# EAGLE schematic lighting (EAGLE 9.7.0)
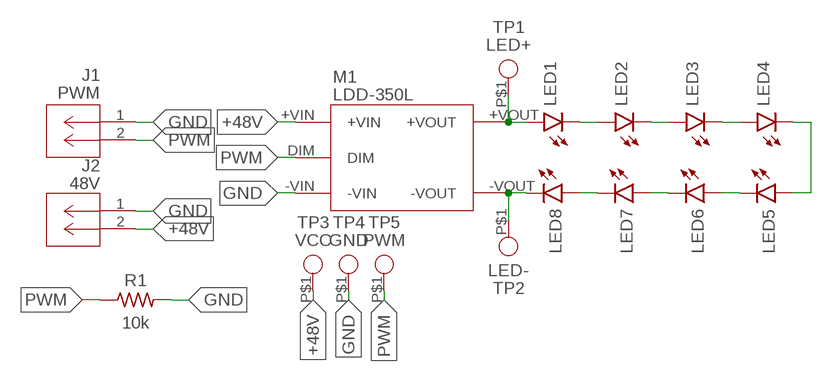
[diagram p0: schematic, sheet 1]

## Parts
J1  PWM  MICROLOCK-2PIN  [2PIN]
J2  48V  2PINCON_436500201_MOL  [2PIN]
LED1  XLAMP_XP-G3_ROYAL  [XLAMP_XP-G3]
LED2  XLAMP_XP-G3_ROYAL  [XLAMP_XP-G3]
LED3  XLAMP_XP-G3_ROYAL  [XLAMP_XP-G3]
LED4  XLAMP_XP-G3_ROYAL  [XLAMP_XP-G3]
LED5  XLAMP_XP-G3_ROYAL  [XLAMP_XP-G3]
LED6  XLAMP_XP-G3_ROYAL  [XLAMP_XP-G3]
LED7  XLAMP_XP-G3_ROYAL  [XLAMP_XP-G3]
LED8  XLAMP_XP-G3_ROYAL  [XLAMP_XP-G3]
M1  LDD-350L  [LDD-L]
R1  10k  R-US_CHIP-0603(1608-METRIC)  [RESC1608X60]
TP1  LED+  TP_CIRCLE_2.5MM  [TP_CIRCLE_2.5MM]
TP2  LED-  TP_CIRCLE_2.5MM  [TP_CIRCLE_2.5MM]
TP3  VCC  TP_CIRCLE_2.5MM  [TP_CIRCLE_2.5MM]
TP4  GND  TP_CIRCLE_2.5MM  [TP_CIRCLE_2.5MM]
TP5  PWM  TP_CIRCLE_2.5MM  [TP_CIRCLE_2.5MM]

## Nets
+48V: J2.2 M1.+VIN TP3.P$1
GND: J1.1 J2.1 M1.-VIN R1.2 TP4.P$1
N$1: LED1.P$1(A) M1.+VOUT TP1.P$1
N$2: LED1.P$2(C) LED2.P$1(A)
N$3: LED2.P$2(C) LED3.P$1(A)
N$4: LED3.P$2(C) LED4.P$1(A)
N$5: LED4.P$2(C) LED5.P$1(A)
N$6: LED5.P$2(C) LED6.P$1(A)
N$7: LED6.P$2(C) LED7.P$1(A)
N$8: LED7.P$2(C) LED8.P$1(A)
N$9: LED8.P$2(C) M1.-VOUT TP2.P$1
PWM: J1.2 M1.DIM R1.1 TP5.P$1

## Library data of the parts
J1 = Molex Micro-Lock PLUS:MICROLOCK-2PIN
J2 = Molex Micro-Fit:2PIN; COPYRIGHT: Copyright (C) 2022 Ultra Librarian. All rights reserved.; MANUFACTURER_PART_NUMBER: 436500201; MFR_NAME: Molex Connector Corporation
LED1-LED8 = XLAMP XP-G3 Royal Blue:XLAMP_XP-G3_ROYAL
M1 = MEAN WELL LDD-L:LDD-350L
R1 = Resistor:R-US: Resistor Fixed - ANSI; CATEGORY: Resistor; SUB-CATEGORY: Fixed
TP1-TP5 = Test Point:TP_CIRCLE_2.5MM